# Altium schematic sheet audio-connectors.SchDoc: Audio Connectors
size A4; Organization: heig-vd; Address1: heig-vd; Address2: Route de Cheseaux 1; Address3: 1401 Yverdon-les-Bains; Address4: Suisse; DocumentNumber: 10; Revision: 1.1; SheetNumber: 10; SheetTotal: 12
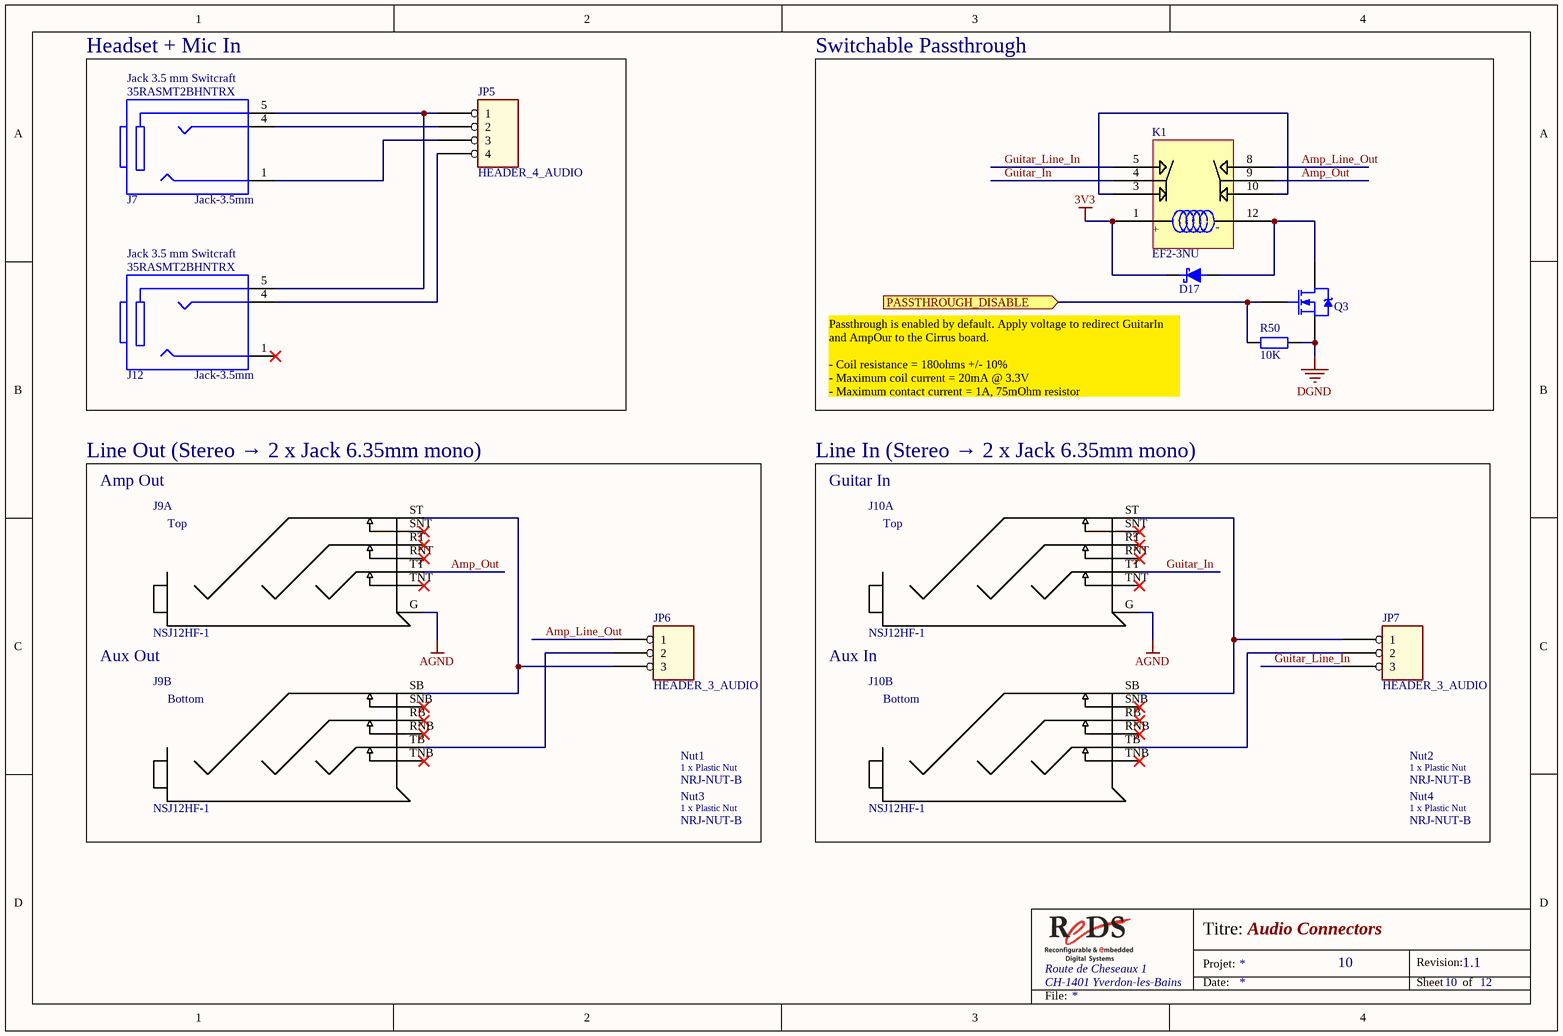
[diagram p0: audio-connectors.SchDoc]

## Parts
D17  B340A  [SM/D_DO214-AC (SMA)]  (value not drawn)
J7  Jack-3.5mm  [CON_JACK_3.5MM_SMD_Switchcraft_35RASMT2BHNTRX]
J9  NSJ12HF-1  [NSJ12HF-1]  (parts A,B of 2)
J10  NSJ12HF-1  [NSJ12HF-1]  (parts A,B of 2)
J12  Jack-3.5mm  [CON_JACK_3.5MM_SMD_Switchcraft_35RASMT2BHNTRX]
JP5  HEADER_4_AUDIO  [HEADER4_WIRE]  (no BOM)
JP6  HEADER_3_AUDIO  [HEADER3_WIRE]  (no BOM)
JP7  HEADER_3_AUDIO  [HEADER3_WIRE]  (no BOM)
K1  EF2-3NU  [EF2-NU]
Nut1  NRJ-NUT-B  (mechanical)
Nut2  NRJ-NUT-B  (mechanical)
Nut3  NRJ-NUT-B  (mechanical)
Nut4  NRJ-NUT-B  (mechanical)
Q3  FDV301N  [SOT23]  (value not drawn)
R50  10K  [SM/R_0603]

## Blocks framed on the sheet
Headset + Mic In: J7 J12 JP5
Switchable Passthrough: D17 K1 Q3 R50
Line Out (Stereo → 2 x Jack 6.35mm mono): J9 JP6 Nut1 Nut3
Line In (Stereo → 2 x Jack 6.35mm mono): J10 JP7 Nut2 Nut4

## Ports
PASSTHROUGH_DISABLE (in)

## Nets
3V3: D17.2(C) K1.1
AGND: J9.G J10.G
DGND: Q3.2(S) R50.2
Amp_Line_Out: JP6.1 K1.8
Amp_Out: J9.TT K1.9
Guitar_In: J10.TT K1.4
Guitar_Line_In: JP7.3 K1.5
PASSTHROUGH_DISABLE: Q3.1(G) R50.1 ; port PASSTHROUGH_DISABLE
NetD17_1: D17.1(A) K1.12 Q3.3(D)
NetJ7_1: J7.1 JP5.3
NetJ7_4: J7.4 JP5.2
NetJ7_5: J7.5(5-GND) J12.5(5-GND) JP5.1
NetJ9_SB: J9.SB J9.ST JP6.3
NetJ9_TB: J9.TB JP6.2
NetJ10_SB: J10.SB J10.ST JP7.1
NetJ10_TB: J10.TB JP7.2
NetJ12_4: J12.4 JP5.4
NetK1_3: K1.3 K1.10

Not connected (* = marked no-connect by the designer): J9 RB* RNB* RNT* RT* SNB* SNT* TNB* TNT*; J10 RB* RNB* RNT* RT* SNB* SNT* TNB* TNT*; J12 1*

## Notes on the sheet
- (near D17) Passthrough is enabled by default. Apply voltage to redirect GuitarIn and AmpOur to the Cirrus board.
  - Coil resistance = 180ohms +/- 10%
  - Maximum coil current = 20mA @ 3.3V
  - Maximum contact current = 1A, 75mOhm resistor
- Amp Out
- Guitar In
- Aux Out
- Aux In
- Route de Cheseaux 1
- CH-1401 Yverdon-les-Bains
- Titre:
- Date:
- Projet:
- Revision:
- Sheet
- of
- File:
- (in symbol 402) Jack 3.5 mm Switcraft
- (in symbol EF2-3NU) +; -
- (in symbol Jack 6.35 NSJ12HF-1, part A) Top
- (in symbol Jack 6.35 NSJ12HF-1, part B) Bottom
- (in symbol Jack 6.35 Plastic Nut) 1 x Plastic Nut

## Library data of the parts
D17 = Diode Schottky B340A: DIODE SCHOTTKY 30V 3A SMA; Supplier 1: Newark; Supplier 2: Mouser; Supplier 3: Allied; Supplier 4: Arrow; Supplier 5: Farnell; Supplier 6: Digi-Key; Supplier 7: Digi-Key; Supplier Part Number 1: 12T1465; Supplier Part Number 2: 621-B340A-F; Supplier Part Number 3: 70437566; Supplier Part Number 5: 1843668; Supplier Part Number 6: B340A-FDICT-ND; Supplier Part Number 7: B340A-FDIDKR-ND
J7 J12 = 402: Connecteur Jack 3.5mm; Manufacturer: Switchcraft; Manufacturer P/N: 35RASMT2BHNTRX; ID: 402; Component Type: Connecteur Jack; Connector Type: Jack 3.5mm; Supplier 1: Digi-Key; Supplier Part Number 1: SC1489-1-ND; Supplier 2: Mouser; Supplier Part Number 2: 502-35RASMT2BHNTRX; ComponentLink1Description: Datasheet; ComponentLink1URL: http://www.mouser.com/ds/2/393/35rasmt2bhntrx_cd-477521.pdf; ComponentLink2Description: Supplier; ComponentLink2URL: http://www.mouser.ch/ProductDetail/Switchcraft/35RASMT2BHNTRX/?qs=%2fha2pyFadugBYbEyIApCbsLN6HSegI9LkYs0hFESYdE9%252b%2fmOK%2fulEw%3d%3d; RoHS Compliant1: True
J9 J10 = Jack 6.35 NSJ12HF-1: Neutronik 2xJack 6.35 connector; Supplier 1: Allied; Supplier 2: Newark; Supplier 3: Mouser; Supplier Part Number 1: 70549361; Supplier Part Number 2: 10J0817; Supplier Part Number 3: 568-NSJ12HF-1
JP5 = HEADER_4_AUDIO: Manufacturer: REDS; RoHS Compliant1: True
JP6 JP7 = HEADER_3_AUDIO: Manufacturer: REDS; RoHS Compliant1: True
K1 = EF2-3NU: Miniature Signal Relay
Nut1-Nut4 = Jack 6.35 Plastic Nut: Plastic Nut to fasten 6.35 jack; Manufacturer: Neutrik; Manufacturer P/N: NRJ-NUT-B; Supplier 1: Mouser; Supplier 2: Allied; Supplier Part Number 1: 550-1005; Supplier Part Number 2: 70088339
Q3 = 2083: MOSFET N-CH 25V 220MA SOT-23; Manufacturer: Fairchild Semiconductor; ID: 2083; Component Type: Transistor MOSFET_N; Manufacturer P/N: FDV301N; Value: FDV301N; Supplier 1: Digi-Key; Supplier Part Number 1: FDV301NCT-ND; Supplier 2: Mouser; Supplier Part Number 2: 512-FDV301N; RoHS Compliant: True; ComponentLink1Description: Datasheet; ComponentLink1URL: http://www.fairchildsemi.com/ds/FD/FDV301N.pdf; ComponentLink2Description: Supplier; ComponentLink2URL: http://www.digikey.fr/product-detail/fr/FDV301N/FDV301NCT-ND/458954
R50 = 133: Résistance 0603 63mW 1% 10K; Manufacturer: Multicomp; Manufacturer P/N: MC 0.036mW 0603 1% 10K; ID: 133; Voltage: 50V; Value: 10K; Component Type: Résistance; Power: 63mW; Tolerance: 1%; Supplier 1: Farnell; Supplier Part Number 1: 9330399; RoHS Compliant: False